# Altium schematic sheet irda.SchDoc
size A4
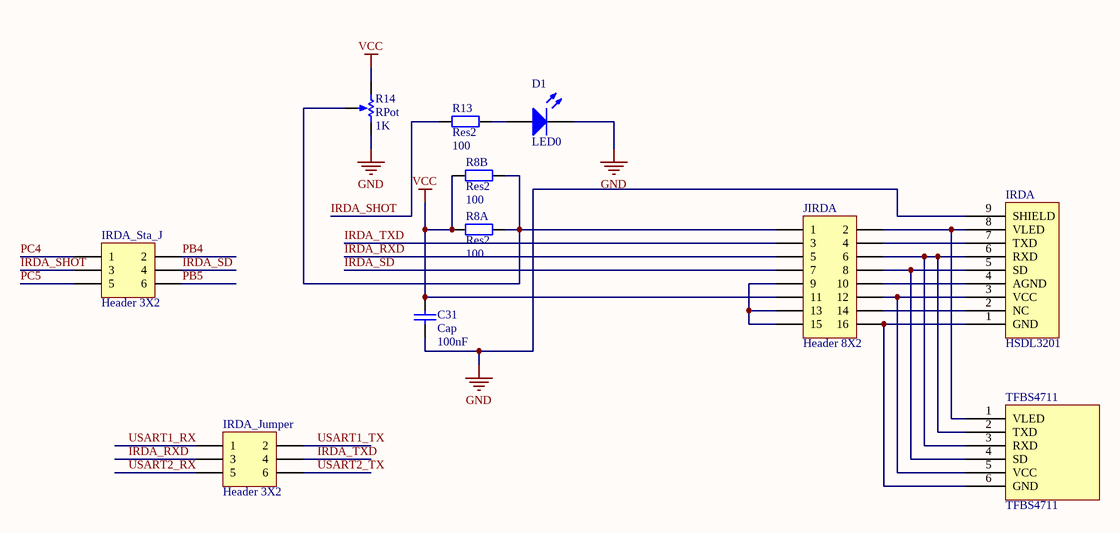
[diagram p0: irda.SchDoc]

## Parts
C31  Cap  value 100nF  [1608[0603]]
D1  LED0  [Cap8*14]
IRDA  HSDL3201  [HSDL3201]
IRDA_Jumper  Header 3X2  [HDR2X3]
IRDA_Sta_J  Header 3X2  [HDR2X3]
JIRDA  Header 8X2  [HDR2X8]
R8A  Res2  value 100  [AXIAL-0.4]
R8B  Res2  value 100  [AXIAL-0.4]
R13  Res2  value 100  [AXIAL-0.4]
R14  RPot  value 1K  [VR5]
TFBS4711  TFBS4711  [TFBS4711]

## Nets
GND: C31.1 D1.2(K) IRDA.9(SHIELD) R14.2(BOT)
VCC: C31.2 JIRDA.11 R8A.2 R8B.2 R14.1(TOP)
IRDA_RXD: IRDA_Jumper.3 JIRDA.5
IRDA_SD: IRDA_Sta_J.4 JIRDA.7
IRDA_SHOT: IRDA_Sta_J.3 R13.1
IRDA_TXD: IRDA_Jumper.4 JIRDA.3
PB4: IRDA_Sta_J.2
PB5: IRDA_Sta_J.6
PC4: IRDA_Sta_J.1
PC5: IRDA_Sta_J.5
USART1_RX: IRDA_Jumper.1
USART1_TX: IRDA_Jumper.2
USART2_RX: IRDA_Jumper.5
USART2_TX: IRDA_Jumper.6
NetD1_1: D1.1(A) R13.2
NetIRDA_1: IRDA.1(GND) JIRDA.16 TFBS4711.6(GND)
NetIRDA_2: IRDA.2(NC) JIRDA.14
NetIRDA_3: IRDA.3(VCC) JIRDA.12 TFBS4711.5(VCC)
NetIRDA_4: IRDA.4(AGND) JIRDA.10
NetIRDA_5: IRDA.5(SD) JIRDA.8 TFBS4711.4(SD)
NetIRDA_6: IRDA.6(RXD) JIRDA.6 TFBS4711.2(TXD) TFBS4711.3(RXD)
NetIRDA_7: IRDA.7(TXD) JIRDA.4
NetIRDA_8: IRDA.8(VLED) JIRDA.2 TFBS4711.1(VLED)
NetJIRDA_1: JIRDA.1 R8A.1 R8B.1 R14.3(TAP)
NetJIRDA_9: JIRDA.9 JIRDA.13 JIRDA.15

## Library data of the parts
C31 = Cap: Capacitor; Published: 8-Jun-2000; LatestRevisionDate: 17-Jul-2002; LatestRevisionNote: Re-released for DXP Platform.; PackageReference: RAD-0.3; Publisher: Altium Limited; PackageDescription: Radial Cap, Thru-Hole; 2 Leads; 0.3 in Pin Spacing
D1 = LED0: Typical INFRARED GaAs LED; Published: 8-Jun-2000; LatestRevisionDate: 08-Jul-2005; LatestRevisionNote: Mech Layer 1 removed.; PackageReference: LED-0; Publisher: Altium Limited; PackageDescription: LED; 2 Leads
IRDA_Jumper IRDA_Sta_J = Header 3X2: Header, 3-Pin, Dual row; LatestRevisionDate: 17-Jul-2002; LatestRevisionNote: Re-released for DXP Platform.; Publisher: Altium Limited
JIRDA = Header 8X2: Header, 8-Pin, Dual row; LatestRevisionDate: 17-Jul-2002; LatestRevisionNote: Re-released for DXP Platform.; Publisher: Altium Limited
R8A R8B R13 = Res2: Resistor; Published: 8-Jun-2000; LatestRevisionDate: 17-Jul-2002; LatestRevisionNote: Re-released for DXP Platform.; PackageReference: AXIAL-0.4; Publisher: Altium Limited; PackageDescription: Axial Device, Thru-Hole; 2 Leads; 0.4 in Pin Spacing
R14 = RPot: Potentiometer; Sim Note: Enter the Resistance value and the set point into parameter fields.; Set Position: 0.5; Published: 8-Jun-2000; LatestRevisionDate: 17-Jul-2002; LatestRevisionNote: Re-released for DXP Platform.; PackageReference: VR5; Publisher: Altium Limited; PackageDescription: Variable Resistor, Thru-Hole; 3 Leads